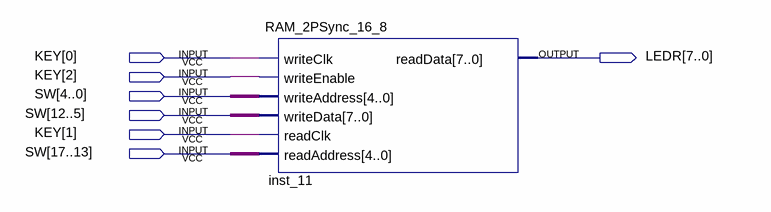
[diagram p0: schematic sheet]
// Quartus schematic RAM_2PSync_Demo.bdf as structural Verilog: 1 symbols, 7 pins
module RAM_2PSync_Demo (
  input  [2:0] KEY,
  input  [17:0] SW,
  output [7:0] LEDR
);

  RAM_2PSync_16_8 inst_11 (
    .writeClk(KEY[0]), .writeEnable(KEY[2]), .writeAddress(SW[4:0]), .writeData(SW[12:5]), .readClk(KEY[1]),
    .readAddress(SW[17:13]), .readData(LEDR));
endmodule
